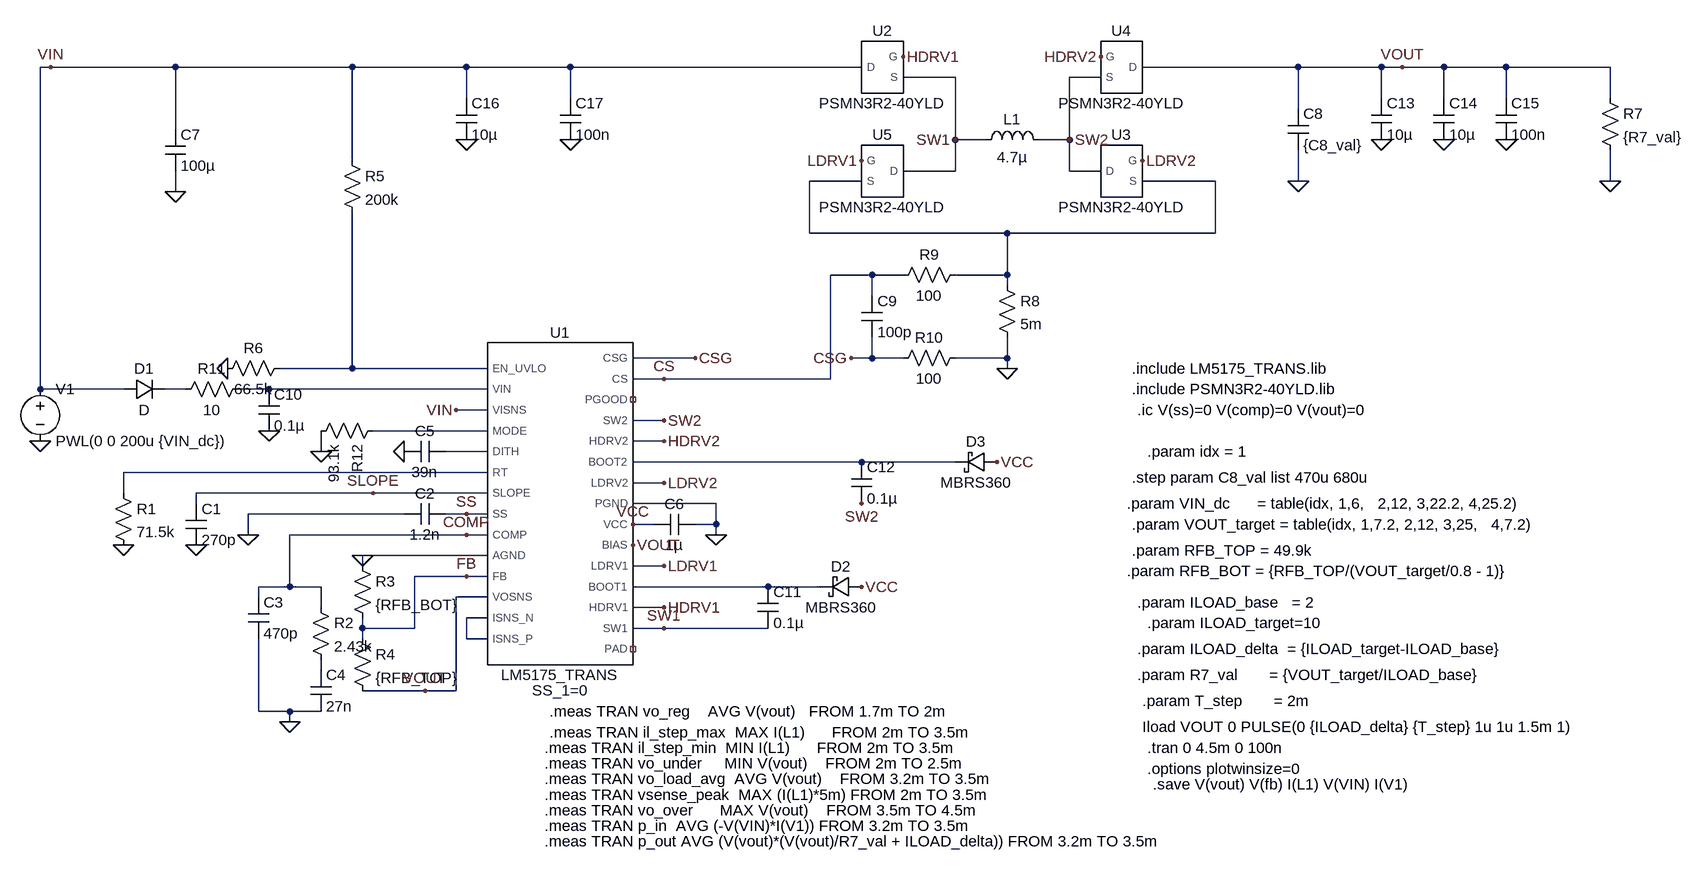
[diagram p0: schematic Buckboost_fixed.asc]
Buckboost_fixed.asc, the LTspice schematic file:
Version 4.1
SHEET 1 2280 992
WIRE -800 -656 -816 -656
WIRE -608 -656 -800 -656
WIRE -336 -656 -608 -656
WIRE -160 -656 -336 -656
WIRE 0 -656 -160 -656
WIRE 448 -656 0 -656
WIRE 1120 -656 880 -656
WIRE 1248 -656 1120 -656
WIRE 1280 -656 1248 -656
WIRE 1344 -656 1280 -656
WIRE 1440 -656 1344 -656
WIRE 1600 -656 1440 -656
WIRE 592 -640 512 -640
WIRE 816 -640 768 -640
WIRE -160 -608 -160 -656
WIRE 0 -608 0 -656
WIRE 1248 -608 1248 -656
WIRE 1344 -608 1344 -656
WIRE 1440 -608 1440 -656
WIRE 1600 -608 1600 -656
WIRE 1120 -592 1120 -656
WIRE -608 -560 -608 -656
WIRE 592 -544 592 -640
WIRE 640 -544 592 -544
WIRE 768 -544 768 -640
WIRE 768 -544 720 -544
WIRE -336 -512 -336 -656
WIRE 592 -496 592 -544
WIRE 592 -496 512 -496
WIRE 768 -496 768 -544
WIRE 816 -496 768 -496
WIRE 448 -480 368 -480
WIRE 992 -480 880 -480
WIRE 1120 -480 1120 -528
WIRE 1600 -480 1600 -528
WIRE -608 -464 -608 -496
WIRE 368 -400 368 -480
WIRE 672 -400 368 -400
WIRE 992 -400 992 -480
WIRE 992 -400 672 -400
WIRE 464 -336 400 -336
WIRE 512 -336 464 -336
WIRE 672 -336 672 -400
WIRE 672 -336 592 -336
WIRE 672 -320 672 -336
WIRE 464 -304 464 -336
WIRE 192 -208 96 -208
WIRE 464 -208 464 -240
WIRE 464 -208 432 -208
WIRE 512 -208 464 -208
WIRE 672 -208 672 -240
WIRE 672 -208 592 -208
WIRE -336 -192 -336 -432
WIRE -336 -192 -448 -192
WIRE -128 -192 -336 -192
WIRE 672 -192 672 -208
WIRE 144 -176 96 -176
WIRE 400 -176 400 -336
WIRE 400 -176 144 -176
WIRE -816 -160 -816 -656
WIRE -688 -160 -816 -160
WIRE -592 -160 -624 -160
WIRE -464 -160 -512 -160
WIRE -128 -160 -464 -160
WIRE -128 -128 -176 -128
WIRE 144 -112 96 -112
WIRE -128 -96 -304 -96
WIRE 144 -80 96 -80
WIRE -384 -64 -384 -96
WIRE -128 -64 -192 -64
WIRE 448 -48 96 -48
WIRE 592 -48 448 -48
WIRE -128 -32 -688 -32
WIRE 144 -16 96 -16
WIRE -688 0 -688 -32
WIRE -304 0 -576 0
WIRE -128 0 -304 0
WIRE -576 16 -576 0
WIRE 224 16 96 16
WIRE -256 32 -496 32
WIRE -160 32 -192 32
WIRE -128 32 -160 32
WIRE 128 48 96 48
WIRE 224 48 224 16
WIRE 224 48 192 48
WIRE -496 64 -496 32
WIRE -160 64 -432 64
WIRE -128 64 -160 64
WIRE 224 64 224 48
WIRE -128 96 -320 96
WIRE -320 112 -320 96
WIRE 144 112 96 112
WIRE -160 128 -240 128
WIRE -128 128 -160 128
WIRE -432 144 -432 64
WIRE -432 144 -480 144
WIRE -384 144 -432 144
WIRE 304 144 96 144
WIRE 384 144 304 144
WIRE -480 160 -480 144
WIRE -128 160 -176 160
WIRE -384 176 -384 144
WIRE 144 176 96 176
WIRE -128 192 -160 192
WIRE -320 208 -320 192
WIRE -240 208 -240 128
WIRE -240 208 -320 208
WIRE 144 208 96 208
WIRE 304 208 144 208
WIRE -320 224 -320 208
WIRE -160 224 -160 192
WIRE -128 224 -160 224
WIRE -384 272 -384 256
WIRE -224 304 -320 304
WIRE -176 304 -176 160
WIRE -176 304 -224 304
WIRE -480 336 -480 224
WIRE -432 336 -480 336
WIRE -384 336 -432 336
WIRE -432 352 -432 336
FLAG -688 80 0
FLAG -576 80 0
FLAG -496 64 0
FLAG -432 352 0
FLAG -256 -64 0
FLAG 224 64 0
FLAG -816 -80 0
FLAG -528 -192 0
FLAG 96 48 VCC
FLAG 144 208 SW1
FLAG 592 -544 SW1
FLAG 144 -112 SW2
FLAG 768 -544 SW2
FLAG 144 112 LDRV1
FLAG 448 -512 LDRV1
FLAG 144 -16 LDRV2
FLAG 880 -512 LDRV2
FLAG 144 176 HDRV1
FLAG 512 -672 HDRV1
FLAG 816 -672 HDRV2
FLAG 144 -80 HDRV2
FLAG -608 -464 0
FLAG 1120 -480 0
FLAG 1600 -480 0
FLAG 192 -208 CSG
FLAG 432 -208 CSG
FLAG 672 -192 0
FLAG 1280 -656 VOUT
FLAG -224 304 VOUT
FLAG -464 -96 0
FLAG 448 144 VCC
FLAG 448 16 SW2
FLAG 656 -48 VCC
FLAG -800 -656 VIN
FLAG -176 -128 VIN
FLAG 96 80 VOUT
FLAG -160 128 FB
FLAG -320 96 0
FLAG -384 -64 0
FLAG -160 32 SS
FLAG -160 64 COMP
FLAG 144 -176 CS
FLAG -304 0 SLOPE
FLAG 0 -544 0
FLAG -160 -544 0
FLAG 1248 -544 0
FLAG 1344 -544 0
FLAG 1440 -544 0
SYMBOL LM5175_TRANS -16 16 R0
SYMATTR InstName U1
SYMBOL res -704 -16 R0
SYMATTR InstName R1
SYMATTR Value 71.5k
SYMBOL cap -592 16 R0
SYMATTR InstName C1
SYMATTR Value 270p
SYMBOL cap -192 16 R90
WINDOW 0 0 32 VBottom 2
WINDOW 3 32 32 VTop 2
SYMATTR InstName C2
SYMATTR Value 1.2n
SYMBOL res -400 160 R0
SYMATTR InstName R2
SYMATTR Value 2.43k
SYMBOL cap -496 160 R0
SYMATTR InstName C3
SYMATTR Value 470p
SYMBOL cap -400 272 R0
SYMATTR InstName C4
SYMATTR Value 27n
SYMBOL cap -192 -80 R90
WINDOW 0 0 32 VBottom 2
WINDOW 3 32 32 VTop 2
SYMATTR InstName C5
SYMATTR Value 39n
SYMBOL res -336 96 R0
SYMATTR InstName R3
SYMATTR Value {RFB_BOT}
SYMBOL res -336 208 R0
SYMATTR InstName R4
SYMATTR Value {RFB_TOP}
SYMBOL cap 192 32 R90
WINDOW 0 0 32 VBottom 2
WINDOW 3 32 32 VTop 2
SYMATTR InstName C6
SYMATTR Value 1µ
SYMBOL voltage -816 -176 R0
WINDOW 123 0 0 Left 0
WINDOW 39 0 0 Left 0
SYMATTR InstName V1
SYMATTR Value PWL(0 0 200u {VIN_dc})
SYMBOL res -352 -528 R0
SYMATTR InstName R5
SYMATTR Value 200k
SYMBOL res -432 -208 R90
WINDOW 0 0 56 VBottom 2
WINDOW 3 32 56 VTop 2
SYMATTR InstName R6
SYMATTR Value 66.5k
SYMBOL PSMN3R2-40YLD 480 -656 R0
SYMATTR InstName U2
SYMBOL PSMN3R2-40YLD 848 -496 R0
SYMATTR InstName U3
SYMBOL PSMN3R2-40YLD 848 -656 M0
SYMATTR InstName U4
SYMBOL PSMN3R2-40YLD 480 -496 M0
SYMATTR InstName U5
SYMBOL ind 624 -528 R270
WINDOW 0 32 56 VTop 2
WINDOW 3 5 56 VBottom 2
SYMATTR InstName L1
SYMATTR Value 4.7µ
SYMATTR SpiceLine Ipk=35 Rser=3m
SYMBOL cap -624 -560 R0
SYMATTR InstName C7
SYMATTR Value 100µ
SYMATTR SpiceLine Rser=30m
SYMBOL res 1584 -624 R0
SYMATTR InstName R7
SYMATTR Value {R7_val}
SYMBOL cap 1104 -592 R0
SYMATTR InstName C8
SYMATTR Value {C8_val}
SYMATTR SpiceLine Rser=30m
SYMBOL res 656 -336 R0
SYMATTR InstName R8
SYMATTR Value 5m
SYMBOL res 608 -352 R90
WINDOW 0 0 56 VBottom 2
WINDOW 3 32 56 VTop 2
SYMATTR InstName R9
SYMATTR Value 100
SYMBOL res 608 -224 R90
WINDOW 0 0 56 VBottom 2
WINDOW 3 32 56 VTop 2
SYMATTR InstName R10
SYMATTR Value 100
SYMBOL cap 448 -304 R0
SYMATTR InstName C9
SYMATTR Value 100p
SYMBOL diode -688 -144 R270
WINDOW 0 32 32 VTop 2
WINDOW 3 0 32 VBottom 2
SYMATTR InstName D1
SYMBOL res -496 -176 R90
WINDOW 0 0 56 VBottom 2
WINDOW 3 32 56 VTop 2
SYMATTR InstName R11
SYMATTR Value 10
SYMBOL cap -480 -160 R0
SYMATTR InstName C10
SYMATTR Value 0.1µ
SYMBOL schottky 448 128 R90
WINDOW 0 0 32 VBottom 2
WINDOW 3 32 32 VTop 2
SYMATTR InstName D2
SYMATTR Value MBRS360
SYMATTR Description Diode
SYMATTR Type diode
SYMBOL cap 288 144 R0
SYMATTR InstName C11
SYMATTR Value 0.1µ
SYMBOL schottky 656 -64 R90
WINDOW 0 0 32 VBottom 2
WINDOW 3 32 32 VTop 2
SYMATTR InstName D3
SYMATTR Value MBRS360
SYMATTR Description Diode
SYMATTR Type diode
SYMBOL cap 432 -48 R0
SYMATTR InstName C12
SYMATTR Value 0.1µ
SYMBOL res -288 -112 R90
SYMATTR InstName R12
SYMATTR Value 93.1k
SYMBOL cap 1232 -608 R0
SYMATTR InstName C13
SYMATTR Value 10µ
SYMATTR SpiceLine Rser=3m
SYMBOL cap 1328 -608 R0
SYMATTR InstName C14
SYMATTR Value 10µ
SYMATTR SpiceLine Rser=3m
SYMBOL cap 1424 -608 R0
SYMATTR InstName C15
SYMATTR Value 100n
SYMATTR SpiceLine Rser=10m
SYMBOL cap -176 -608 R0
SYMATTR InstName C16
SYMATTR Value 10µ
SYMATTR SpiceLine Rser=3m
SYMBOL cap -16 -608 R0
SYMATTR InstName C17
SYMATTR Value 100n
SYMATTR SpiceLine Rser=10m
TEXT 864 -192 Left 2 !.include LM5175_TRANS.lib
TEXT 864 -160 Left 2 !.include PSMN3R2-40YLD.lib
TEXT 872 -128 Left 2 !.ic V(ss)=0 V(comp)=0 V(vout)=0
TEXT 888 -64 Left 2 !.param idx = 1
TEXT 864 -24 Left 2 !.step param C8_val list 470u 680u
TEXT 856 16 Left 2 !.param VIN_dc      = table(idx, 1,6,   2,12, 3,22.2, 4,25.2)
TEXT 864 48 Left 2 !.param VOUT_target = table(idx, 1,7.2, 2,12, 3,25,   4,7.2)
TEXT 864 88 Left 2 !.param RFB_TOP = 49.9k
TEXT 856 120 Left 2 !.param RFB_BOT = {RFB_TOP/(VOUT_target/0.8 - 1)}
TEXT 872 168 Left 2 !.param ILOAD_base   = 2
TEXT 888 200 Left 2 !.param ILOAD_target=10
TEXT 872 240 Left 2 !.param ILOAD_delta  = {ILOAD_target-ILOAD_base}
TEXT 872 280 Left 2 !.param R7_val       = {VOUT_target/ILOAD_base}
TEXT 880 320 Left 2 !.param T_step       = 2m
TEXT 880 360 Left 2 !Iload VOUT 0 PULSE(0 {ILOAD_delta} {T_step} 1u 1u 1.5m 1)
TEXT 888 392 Left 2 !.tran 0 4.5m 0 100n
TEXT 888 424 Left 2 !.options plotwinsize=0
TEXT 896 448 Left 2 !.save V(vout) V(fb) I(L1) V(VIN) I(V1)
TEXT -32 368 Left 2 !.meas TRAN il_step_max  MAX I(L1)      FROM 2m TO 3.5m
TEXT -40 392 Left 2 !.meas TRAN il_step_min  MIN I(L1)      FROM 2m TO 3.5m
TEXT -40 416 Left 2 !.meas TRAN vo_under     MIN V(vout)    FROM 2m TO 2.5m
TEXT -40 440 Left 2 !.meas TRAN vo_load_avg  AVG V(vout)    FROM 3.2m TO 3.5m
TEXT -40 464 Left 2 !.meas TRAN vsense_peak  MAX (I(L1)*5m) FROM 2m TO 3.5m
TEXT -40 488 Left 2 !.meas TRAN vo_over      MAX V(vout)    FROM 3.5m TO 4.5m
TEXT -40 512 Left 2 !.meas TRAN p_in  AVG (-V(VIN)*I(V1)) FROM 3.2m TO 3.5m
TEXT -40 536 Left 2 !.meas TRAN p_out AVG (V(vout)*(V(vout)/R7_val + ILOAD_delta)) FROM 3.2m TO 3.5m
TEXT -32 336 Left 2 !.meas TRAN vo_reg    AVG V(vout)   FROM 1.7m TO 2m

The netlist it stands for:
* Buckboost_fixed.asc
X§U1 N002 N004 VIN N005 N006 N008 SLOPE SS COMP 0 FB VOUT N010 N010 CSG CS NC_01 SW2 HDRV2 N007 LDRV2 0 VCC VOUT LDRV1 N009 HDRV1 SW1 NC_02 LM5175_TRANS SS_1=0  ; pins EN_UVLO VIN VISNS MODE DITH RT SLOPE SS COMP AGND FB VOSNS ISNS_N ISNS_P CSG CS PGOOD SW2 HDRV2 BOOT2 LDRV2 PGND VCC BIAS LDRV1 BOOT1 HDRV1 SW1 PAD
R1 N008 0 71.5k
C1 SLOPE 0 270p
C2 SS 0 1.2n
R2 COMP N011 2.43k
C3 COMP 0 470p
C4 N011 0 27n
C5 N006 0 39n
R3 0 FB {RFB_BOT}
R4 FB VOUT {RFB_TOP}
C6 0 VCC 1µ
V1 VIN 0 PWL(0 0 200u {VIN_dc})
R5 VIN N002 200k
R6 N002 0 66.5k
X§U2 VIN HDRV1 SW1 PSMN3R2-40YLD  ; pins D G S
X§U3 SW2 LDRV2 N001 PSMN3R2-40YLD  ; pins D G S
X§U4 VOUT HDRV2 SW2 PSMN3R2-40YLD  ; pins D G S
X§U5 SW1 LDRV1 N001 PSMN3R2-40YLD  ; pins D G S
L1 SW1 SW2 4.7µ Ipk=35 Rser=3m
C7 VIN 0 100µ Rser=30m
R7 VOUT 0 {R7_val}
C8 VOUT 0 {C8_val} Rser=30m
R8 N001 0 5m
R9 N001 CS 100
R10 0 CSG 100
C9 CS CSG 100p
D1 VIN N003 D
R11 N004 N003 10
C10 N004 0 0.1µ
D2 VCC N009 MBRS360
C11 N009 SW1 0.1µ
D3 VCC N007 MBRS360
C12 N007 SW2 0.1µ
R12 N005 0 93.1k
C13 VOUT 0 10µ Rser=3m
C14 VOUT 0 10µ Rser=3m
C15 VOUT 0 100n Rser=10m
C16 VIN 0 10µ Rser=3m
C17 VIN 0 100n Rser=10m
.model D D
.lib standard.dio
.include LM5175_TRANS.lib
.include PSMN3R2-40YLD.lib
.ic V(ss)=0 V(comp)=0 V(vout)=0
.param idx = 1
.step param C8_val list 470u 680u
.param VIN_dc      = table(idx, 1,6,   2,12, 3,22.2, 4,25.2)
.param VOUT_target = table(idx, 1,7.2, 2,12, 3,25,   4,7.2)
.param RFB_TOP = 49.9k
.param RFB_BOT = {RFB_TOP/(VOUT_target/0.8 - 1)}
.param ILOAD_base   = 2
.param ILOAD_target=10
.param ILOAD_delta  = {ILOAD_target-ILOAD_base}
.param R7_val       = {VOUT_target/ILOAD_base}
.param T_step       = 2m
Iload VOUT 0 PULSE(0 {ILOAD_delta} {T_step} 1u 1u 1.5m 1)
.tran 0 4.5m 0 100n
.options plotwinsize=0
.save V(vout) V(fb) I(L1) V(VIN) I(V1)
.meas TRAN il_step_max  MAX I(L1)      FROM 2m TO 3.5m
.meas TRAN il_step_min  MIN I(L1)      FROM 2m TO 3.5m
.meas TRAN vo_under     MIN V(vout)    FROM 2m TO 2.5m
.meas TRAN vo_load_avg  AVG V(vout)    FROM 3.2m TO 3.5m
.meas TRAN vsense_peak  MAX (I(L1)*5m) FROM 2m TO 3.5m
.meas TRAN vo_over      MAX V(vout)    FROM 3.5m TO 4.5m
.meas TRAN p_in  AVG (-V(VIN)*I(V1)) FROM 3.2m TO 3.5m
.meas TRAN p_out AVG (V(vout)*(V(vout)/R7_val + ILOAD_delta)) FROM 3.2m TO 3.5m
.meas TRAN vo_reg    AVG V(vout)   FROM 1.7m TO 2m
.lib LM5175_TRANS.lib
.lib PSMN3R2-40YLD.lib
.backanno
.end